# EAGLE design Switch (EAGLE 5.06)
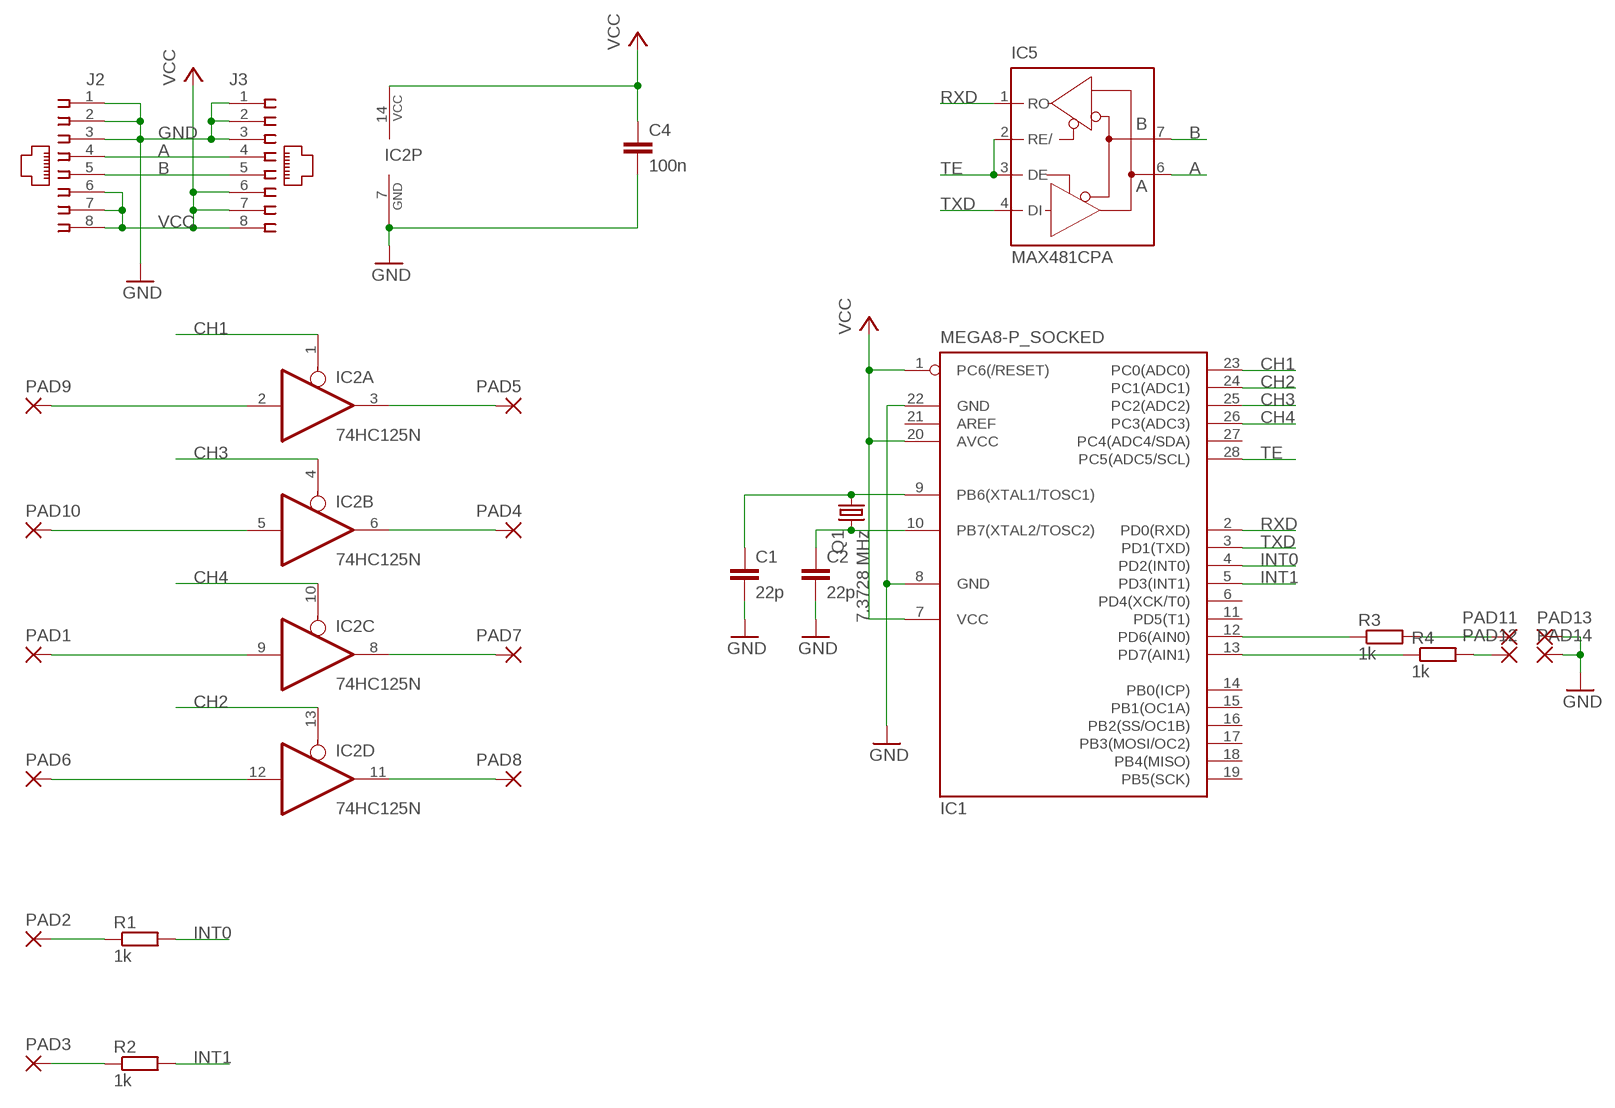
[diagram p0: schematic, sheet 1]

## Parts
C1  22p  C-EUC1206  [C1206]
C2  22p  C-EUC1206  [C1206]
C4  100n  C-EUC1206  [C1206]
IC1  MEGA8-P_SOCKED  [SOKL-28U]
IC2  74HC125N  74LS125N  [DIL14]
IC5  MAX481CPA  [DIL08]
J2  520426-4  [520426-4]
J3  520426-4  [520426-4]
PAD1  2,54/0,8  [2,54/0,8]
PAD2  2,54/0,8  [2,54/0,8]
PAD3  2,54/0,8  [2,54/0,8]
PAD4  2,54/0,8  [2,54/0,8]
PAD5  2,54/0,8  [2,54/0,8]
PAD6  2,54/0,8  [2,54/0,8]
PAD7  2,54/0,8  [2,54/0,8]
PAD8  2,54/0,8  [2,54/0,8]
PAD9  2,54/0,8  [2,54/0,8]
PAD10  2,54/0,8  [2,54/0,8]
PAD11  2,54/0,8  [2,54/0,8]
PAD12  2,54/0,8  [2,54/0,8]
PAD13  2,54/0,8  [2,54/0,8]
PAD14  2,54/0,8  [2,54/0,8]
Q1  7.3728 MHz  CRYSTALHC49S  [HC49/S]
R1  1k  R-EU_R1206  [R1206]
R2  1k  R-EU_R1206  [R1206]
R3  1k  R-EU_R1206  [R1206]
R4  1k  R-EU_R1206  [R1206]

## Nets
A: IC5.6(A) J2.4 J3.4
B: IC5.7(B) J2.5 J3.5
C1I: IC2.2(A:I) PAD9.1(P)
C1O: IC2.3(A:O) PAD5.1(P)
C2I: IC2.12(D:I) PAD6.1(P)
C2O: IC2.11(D:O) PAD8.1(P)
C3I: IC2.5(B:I) PAD10.1(P)
C3O: IC2.6(B:O) PAD4.1(P)
C4I: IC2.9(C:I) PAD1.1(P)
C4O: IC2.8(C:O) PAD7.1(P)
CH1: IC1.23(PC0(ADC0)) IC2.1(A:OE)
CH2: IC1.24(PC1(ADC1)) IC2.13(D:OE)
CH3: IC1.25(PC2(ADC2)) IC2.4(B:OE)
CH4: IC1.26(PC3(ADC3)) IC2.10(C:OE)
GND: C1.2 C2.2 C4.2 IC1.8(GND) IC1.22(GND) IC2.7(P:GND) J2.1 J2.2 J2.3 J3.1 J3.2 J3.3 PAD13.1(P) PAD14.1(P)
INT0: IC1.4(PD2(INT0)) R1.2
INT1: IC1.5(PD3(INT1)) R2.2
N$1: PAD2.1(P) R1.1
N$2: PAD3.1(P) R2.1
N$11: C1.1 IC1.9(PB6(XTAL1/TOSC1)) Q1.1
N$12: C2.1 IC1.10(PB7(XTAL2/TOSC2)) Q1.2
N$13: IC1.12(PD6(AIN0)) R3.1
N$14: IC1.13(PD7(AIN1)) R4.1
N$15: PAD12.1(P) R4.2
N$16: PAD11.1(P) R3.2
RXD: IC1.2(PD0(RXD)) IC5.1(RO)
TE: IC1.28(PC5(ADC5/SCL)) IC5.2(RE/) IC5.3(DE)
TXD: IC1.3(PD1(TXD)) IC5.4(DI)
VCC: C4.1 IC1.1(PC6(/RESET)) IC1.7(VCC) IC1.20(AVCC) IC2.14(P:VCC) J2.6 J2.7 J2.8 J3.6 J3.7 J3.8
Unconnected: IC1.6(PD4(XCK/T0)) IC1.11(PD5(T1)) IC1.14(PB0(ICP)) IC1.15(PB1(OC1A)) IC1.16(PB2(SS/OC1B)) IC1.17(PB3(MOSI/OC2)) IC1.18(PB4(MISO)) IC1.19(PB5(SCK)) IC1.21(AREF) IC1.27(PC4(ADC4/SDA))

## Power pins joined to a net without a drawn wire
GND: IC5.5(GND)
VCC: IC5.8(VCC)

## Library data of the parts
C1 C2 C4 = rcl:C-EU: CAPACITOR, European symbol
IC1 = atmel:MEGA8-P: MICROCONTROLLER 8 Kbytes FLASH, 1 kbytes SRAM, 512 bytes EEPROM, USART, 4-channel 10 bit ADC, 2-channel 8 bit ADC Pin compatible with Atmega48, ATMega88, ATMega168 Source: avr.lbr
IC2 = 74xx-us:74*125: Quad bus BUFFER, 3-state
IC5 = maxim:MAX481CPA: RS485 TRANSEIVER
J2 J3 = con-amp:520426-4: AMP connector
PAD1-PAD14 = wirepad:2,54/0,8: THROUGH-HOLE PAD
Q1 = crystal:CRYSTAL: CRYSTAL
R1-R4 = rcl:R-EU_: RESISTOR, European symbol

## Board
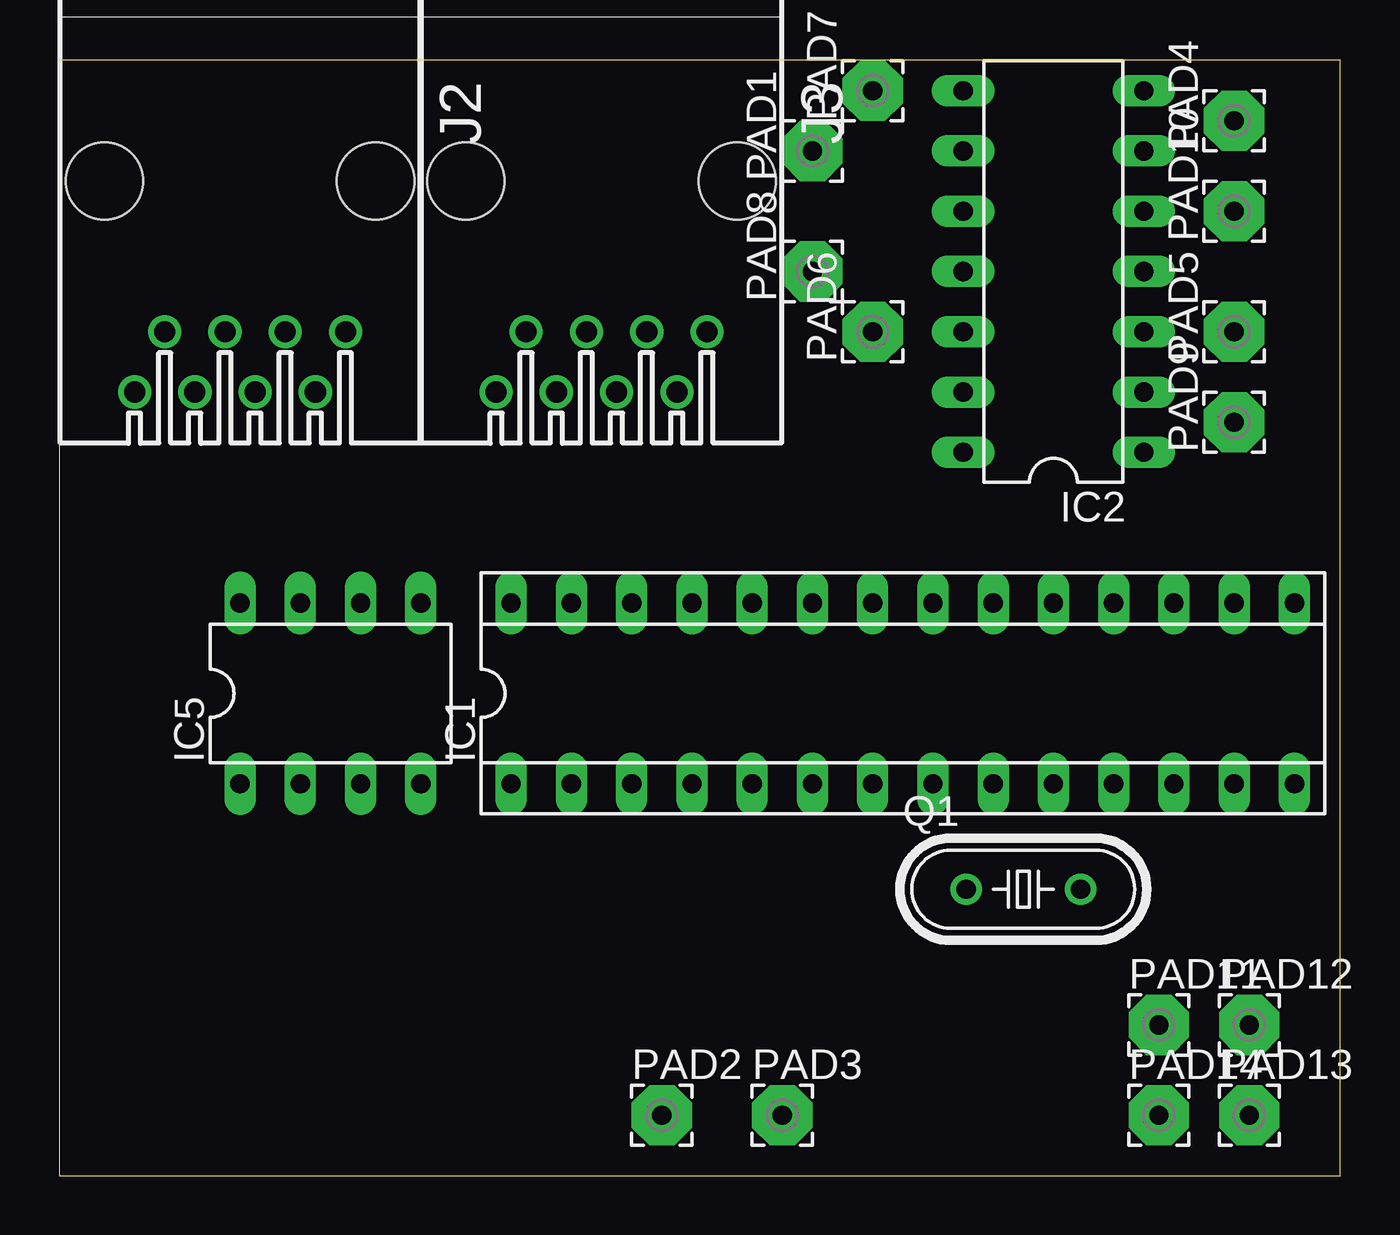
[diagram p1: board, top side]
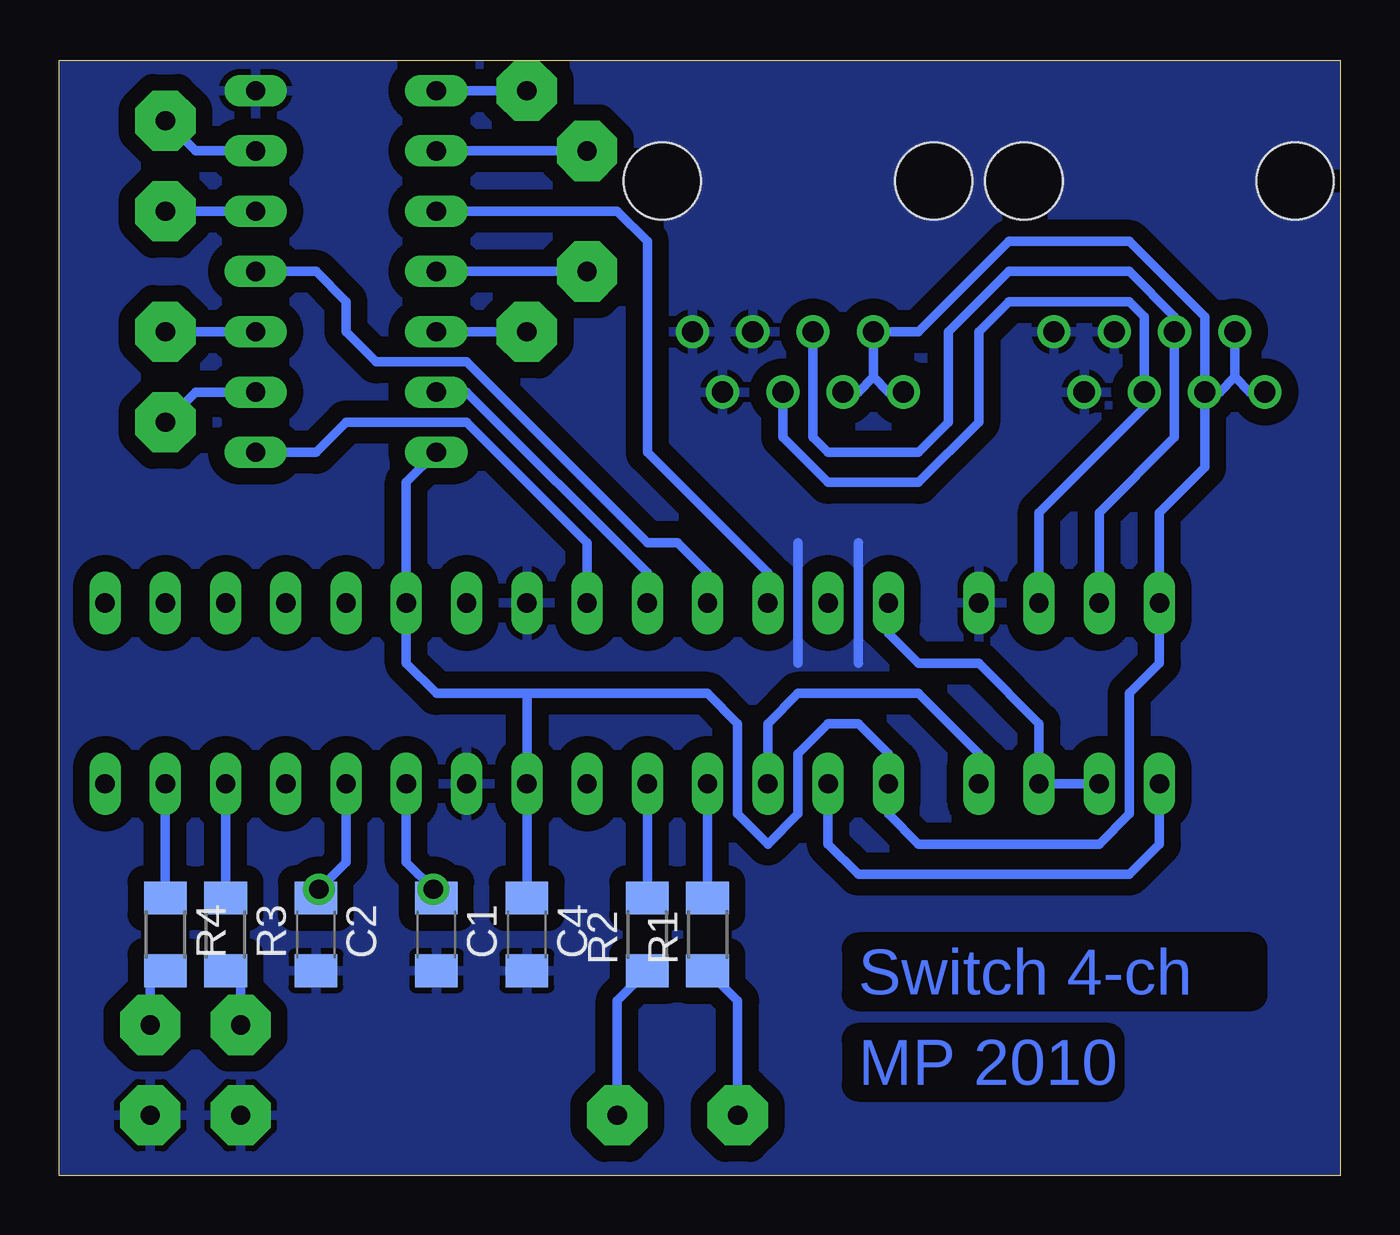
[diagram p2: board, bottom side, seen from below]

Size 54 x 47 mm. Coordinates in mm from the lower left corner, seen from the top.
Outline: 0,0 54,0 54,47 0,47 0,0
Copper layers (1*16): Top 0.035mm / dielectric 1.5mm / Bottom 0.035mm
Design rules "Michal_big": minimum track width 0.1mm, minimum drill 0.3mm, track to track 0.7mm, track to pad 0.7mm, pad to pad 0.5mm, via to via 1mm, smd to smd 8mil, copper to edge 1mil, drill to drill 8mil, minimum pad ring 10mil, minimum via ring 8mil, stop-mask expansion 4mil, vias tented up to drill 0mil, thermal gap 10mil

### Footprints (pad centres in the part's own frame; a part is rotated, then mirrored left to right if it is on the bottom)
C1206 = smd 1.375 x 1.8: 1 -1.53,0; 2 1.53,0
SOKL-28U = drill 0.813 long: 1 -16.51,-3.81; 2 -13.97,-3.81; 3 -11.43,-3.81; 4 -8.89,-3.81; 5 -6.35,-3.81; 6 -3.81,-3.81; 7 -1.27,-3.81; 8 1.27,-3.81; 9 3.81,-3.81; 10 6.35,-3.81; 11 8.89,-3.81; 12 11.43,-3.81; 13 13.97,-3.81; 14 16.51,-3.81; 15 16.51,3.81; 16 13.97,3.81; 17 11.43,3.81; 18 8.89,3.81; 19 6.35,3.81; 20 3.81,3.81; 21 1.27,3.81; 22 -1.27,3.81; 23 -3.81,3.81; 24 -6.35,3.81; 25 -8.89,3.81; 26 -11.43,3.81; 27 -13.97,3.81; 28 -16.51,3.81
DIL14 = drill 0.813 long: 1 -7.62,-3.81; 2 -5.08,-3.81; 3 -2.54,-3.81; 4 0,-3.81; 5 2.54,-3.81; 6 5.08,-3.81; 7 7.62,-3.81; 8 7.62,3.81; 9 5.08,3.81; 10 2.54,3.81; 11 0,3.81; 12 -2.54,3.81; 13 -5.08,3.81; 14 -7.62,3.81
DIL08 = drill 0.813 long: 1 -3.81,-3.81; 2 -1.27,-3.81; 3 1.27,-3.81; 4 3.81,-3.81; 5 3.81,3.81; 6 1.27,3.81; 7 -1.27,3.81; 8 -3.81,3.81
520426-4 = drill 0.889 round: 1 -4.445,6.35; 2 -3.175,8.89; 3 -1.905,6.35; 4 -0.635,8.89; 5 0.635,6.35; 6 1.905,8.89; 7 3.175,6.35; 8 4.445,8.89 | hole 3.251: -5.715,0; 5.715,0
2,54/0,8 = drill 0.813 pad 2.54 octagon: 1 0,0
HC49/S = drill 0.813 round: 1 -2.413,0; 2 2.413,0
R1206 = smd 1.375 x 1.8: 1 -1.53,0; 2 1.53,0

### Placement (x,y rotation side)
C1  38.1,10.16 270 bottom
C2  43.18,10.16 270 bottom
C4  34.29,10.16 270 bottom
IC1  35.56,20.32 0 top
IC2  41.91,38.1 90 top
IC5  11.43,20.32 0 top
J2  7.62,41.91 180 top
J3  22.86,41.91 180 top
PAD1  31.75,43.18 90 top
PAD2  25.4,2.54 0 top
PAD3  30.48,2.54 0 top
PAD4  49.53,44.45 90 top
PAD5  49.53,35.56 90 top
PAD6  34.29,35.56 90 top
PAD7  34.29,45.72 90 top
PAD8  31.75,38.1 90 top
PAD9  49.53,31.75 90 top
PAD10  49.53,40.64 90 top
PAD11  46.35,6.35 0 top
PAD12  50.16,6.35 0 top
PAD13  50.16,2.54 0 top
PAD14  46.35,2.54 0 top
Q1  40.64,12.06 0 top
R1  26.67,10.16 90 bottom
R2  29.21,10.16 90 bottom
R3  46.99,10.16 270 bottom
R4  49.53,10.16 270 bottom

### Tracks (layer width: path | path; a pad name or v marks a point on that pad's centre or on a via)
A
  Bottom 0.406: J3.4 23.5,31.11 21.59,29.21 17.78,29.21 15.24,31.75 15.24,35.56 13.97,36.83 8.89,36.83 8.26,36.2 J2.4 8.26,32.38 12.7,27.94 IC5.6
B
  Bottom 0.406: J3.5 22.23,31.11 21.59,30.48 17.78,30.48 16.51,31.75 16.51,35.56 13.97,38.1 8.89,38.1 6.99,36.2 J2.5 6.99,31.11 10.16,27.94 IC5.7
C1I
  Bottom 0.406: IC2.2 48.26,33.02 PAD9.1
C1O
  Bottom 0.406: IC2.3 PAD5.1
C2I
  Bottom 0.406: PAD6.1 IC2.12
C2O
  Bottom 0.406: PAD8.1 IC2.11
C3I
  Bottom 0.406: IC2.5 PAD10.1
C3O
  Bottom 0.406: IC2.6 48.26,43.18 PAD4.1
C4I
  Bottom 0.406: PAD1.1 IC2.9
C4O
  Bottom 0.406: PAD7.1 IC2.8
CH1
  Bottom 0.406: IC1.23 31.75,26.67 36.83,31.75 41.91,31.75 43.18,30.48 IC2.1
CH2
  Bottom 0.406: IC2.13 36.83,33.02 29.21,25.4 IC1.24
CH3
  Bottom 0.406: IC1.25 26.67,25.4 27.94,26.67 29.21,26.67 36.83,34.29 40.64,34.29 41.91,35.56 41.91,36.83 43.18,38.1 IC2.4
CH4
  Bottom 0.406: IC1.26 24.13,25.4 29.21,30.48 29.21,39.37 30.48,40.64 IC2.10
GND
  Bottom 0.406: 20.32,21.59 20.32,26.67 | 22.86,21.59 22.86,26.67
  pour Bottom: 0,47 54,47 54,0 0,0
INT0
  Bottom 0.406: R1.2 IC1.4
INT1
  Bottom 0.406: R2.2 IC1.5
N$1
  Bottom 0.406: PAD2.1 25.4,7.36 R1.1
N$2
  Bottom 0.406: PAD3.1 30.48,7.36 R2.1
N$11
  Bottom 0.406: IC1.9 39.37,13.21 Q1.1 38.1,11.94 C1.1
N$12
  Bottom 0.406: IC1.10 41.91,13.21 Q1.2 43.18,11.94 C2.1
N$13
  Bottom 0.406: R3.1 IC1.12
N$14
  Bottom 0.406: R4.1 IC1.13
N$15
  Bottom 0.406: PAD12.1 50.16,8 R4.2
N$16
  Bottom 0.406: PAD11.1 46.35,8 R3.2
RXD
  Bottom 0.406: IC5.1 7.62,13.97 8.89,12.7 20.32,12.7 21.59,13.97 IC1.2
TE
  Bottom 0.406: IC5.2 IC5.3 12.7,19.05 15.24,21.59 17.78,21.59 19.05,22.86 IC1.28
TXD
  Bottom 0.406: IC5.4 15.24,17.78 17.78,20.32 22.86,20.32 24.13,19.05 IC1.3
VCC
  Bottom 0.406: 4.45,33.66 J2.7 | 4.45,33.66 5.08,33.02 J2.6 | J2.8 3.81,33.02 4.45,33.66 | J3.6 20.32,33.02 19.68,33.66 | 19.68,33.66 J3.7 17.78,35.56 13.97,39.37 8.89,39.37 5.71,36.2 J2.6 | 19.68,33.66 19.05,33.02 J3.8 | 34.29,20.32 38.1,20.32 39.37,21.59 IC1.20 39.37,29.21 IC2.14 | 34.29,20.32 26.67,20.32 25.4,19.05 25.4,15.24 24.13,13.97 22.86,15.24 22.86,17.78 21.59,19.05 20.32,19.05 19.05,17.78 IC1.1 19.05,15.24 17.78,13.97 10.16,13.97 8.89,15.24 8.89,20.32 7.62,21.59 IC5.8 7.62,27.94 5.71,29.84 J2.6 | 34.29,20.32 IC1.7 C4.1

### Text on the board
Bottom: Switch 4-ch | MP 2010